# Altium schematic sheet ATtiny_Connections.SchDoc: ATiny_connections
size A4; Organization: Ernst-Abbe-Hochschule Jena; Address1: FB Maschinenbau; Address2: Carl-Zeiss-Promenade 2; Address3: 07745 Jena; Address4: Germany; DocumentNumber: 2; SheetNumber: 2; SheetTotal: 3; SPICEModelCacheYXNNQHYV: <root> / <DocumentId>YXNNQHYV</DocumentId> / </root>
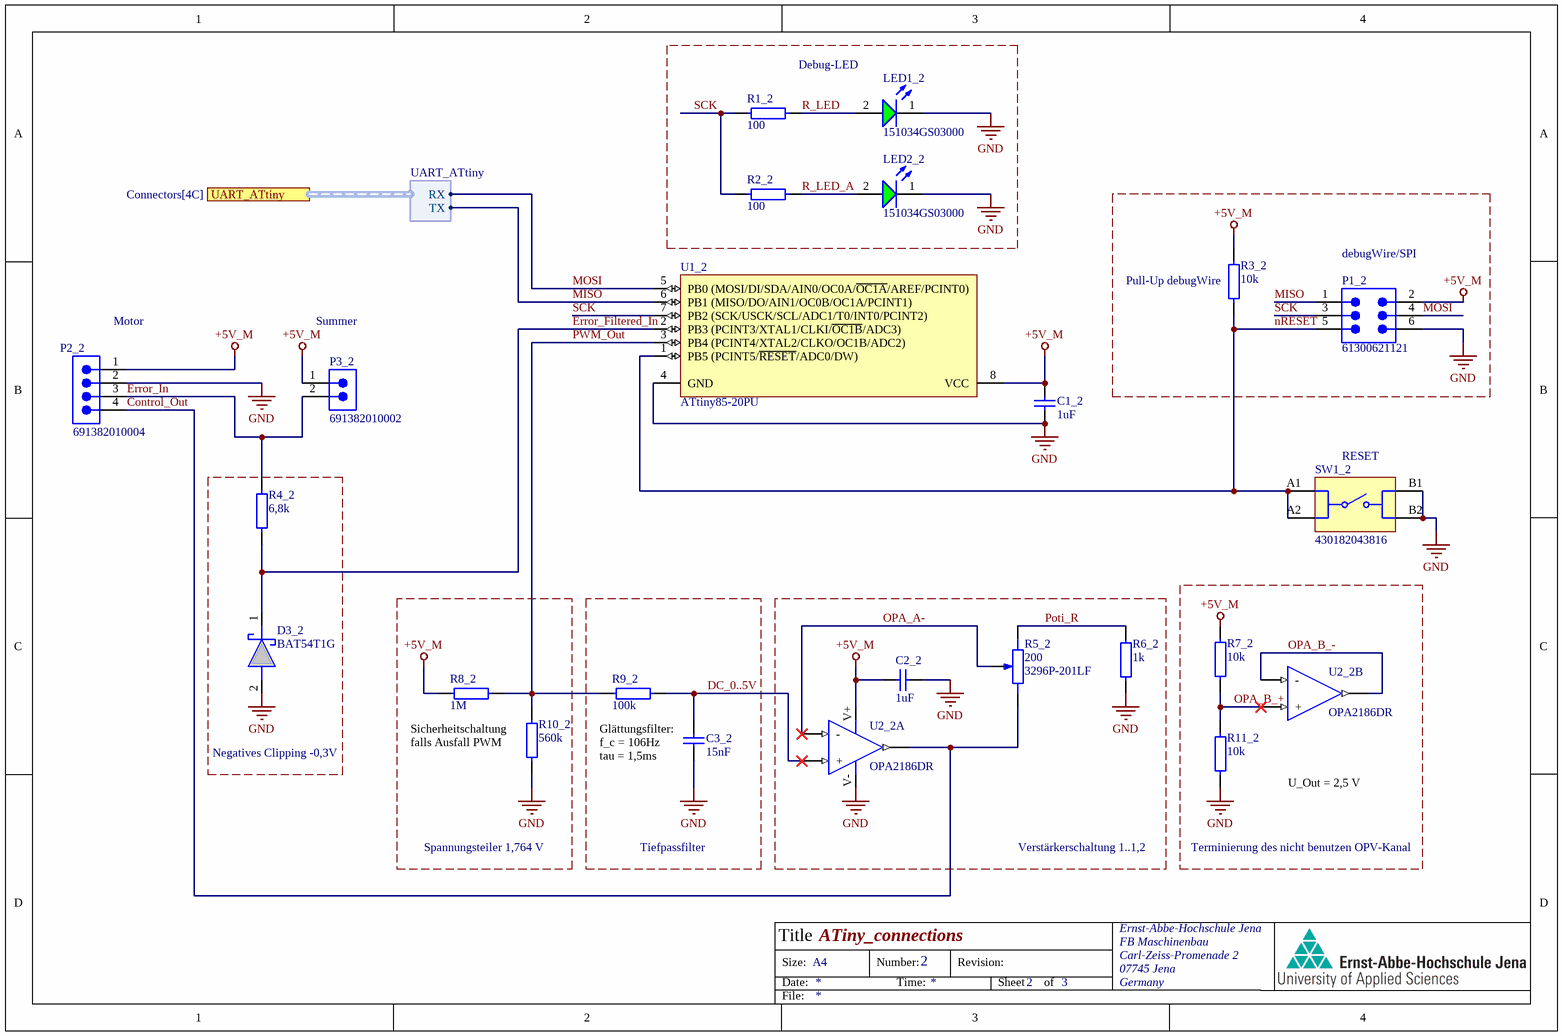
[diagram p0: ATtiny_Connections.SchDoc]

## Parts
C1_2  1uF  [SMD-0805]
C2_2  1uF  [SMD-0805]
C3_2  15nF  [SMD-0805]
D3_2  BAT54T1G  [SOD3716X135N]
LED1_2  Green, 3.2V, 30°  [WL-TMRW_D3.9H5.3]  (value not drawn)
LED2_2  Green, 3.2V, 30°  [WL-TMRW_D3.9H5.3]  (value not drawn)
P1_2  61300621121  [61300621121]
P2_2  691382010004  [691382010004]
P3_2  691382010002  [691382010002]
R1_2  100  [R-SMD-0805]
R2_2  100  [R-SMD-0805]
R3_2  10k  [R-SMD-0805]
R4_2  6,8k  [R-SMD-0805]
R5_2  200  Manufacturer Part Nr.: 3296P-201LF  [3296P-1-201LF]
R6_2  1k  [R-SMD-0805]
R7_2  10k  [R-SMD-0805]
R8_2  1M  [R-SMD-0805]
R9_2  100k  [R-SMD-0805]
R10_2  560k  [R-SMD-0805]
R11_2  10k  [R-SMD-0805]
SW1_2  430182043816  [430182043816]
U1_2  ATtiny85-20PU  [8P3]
U2_2  OPA2186DR  [SOIC127P600-8BM]  (parts A,B of 2)

## Blocks framed on the sheet
Debug-LED: LED1_2 LED2_2 R1_2 R2_2
Negatives Clipping -0,3V: D3_2 R4_2
Spannungsteiler 1,764 V: R8_2 R10_2
Tiefpassfilter: C3_2 R9_2
Verstärkerschaltung 1..1,2: C2_2 R5_2 R6_2 U2_2
Terminierung des nicht benutzen OPV-Kanal: R7_2 R11_2 U2_2

## Ports
UART_ATtiny (harness UART_ATtiny, see Connectors[4C])

## Harnesses
UART_ATtiny: RX, TX

## Nets
+5V_M: C1_2.2 C2_2.2 P1_2.2 P2_2.1 P3_2.1 R3_2.2 R7_2.2 R8_2.1 U1_2.8(VCC) U2_2.V+
GND: C1_2.1 C2_2.1 C3_2.1 D3_2.2(A) LED1_2.1(K) LED2_2.1(K) P1_2.6 P2_2.2 R6_2.2 R10_2.1 R11_2.1 SW1_2.B1 SW1_2.B2 U1_2.4(GND) U2_2.V-
Control_Out: P2_2.4 R5_2.1 U2_2.OUTA(OUT)
DC_0..5V: C3_2.2 R9_2.2 U2_2.IPA(+)
Error_Filtered_In: D3_2.1(K) R4_2.1 U1_2.2(PB3_(PCINT3/XTAL1/CLKI/~{OC1B}/ADC3))
Error_In: P2_2.3 P3_2.2 R4_2.2
MISO: P1_2.1 U1_2.6(PB1_(MISO/DO/AIN1/OC0B/OC1A/PCINT1)) ; port UART_ATtiny.TX
MOSI: P1_2.4 U1_2.5(PB0_(MOSI/DI/SDA/AIN0/OC0A/~{OC1A}/AREF/PCINT0)) ; port UART_ATtiny.RX
nRESET: P1_2.5 R3_2.1 SW1_2.A1 SW1_2.A2 U1_2.1(PB5_(PCINT5/~{RESET}/ADC0/DW))
OPA_A-: R5_2.2(TAP) U2_2.INA(-)
OPA_B_+: R7_2.1 R11_2.2 U2_2.IPB(+)
OPA_B_-: U2_2.INB(-) U2_2.OUTB(OUT)
Poti_R: R5_2.3 R6_2.1
PWM_Out: R8_2.2 R9_2.1 R10_2.2 U1_2.3(PB4_(PCINT4/XTAL2/CLKO/OC1B/ADC2))
R_LED: LED1_2.2(A) R1_2.2
R_LED_A: LED2_2.2(A) R2_2.2
SCK: P1_2.3 R1_2.1 R2_2.1 U1_2.7(PB2_(SCK/USCK/SCL/ADC1/T0/INT0/PCINT2))

## Notes on the sheet
- (near R3_2) Pull-Up debugWire
- (near P1_2) debugWire/SPI
- (near P2_2) Motor
- Summer
- (near SW1_2) RESET
- (near R10_2) Sicherheitschaltung falls Ausfall PWM
- (near C3_2) Glättungsfilter:
  f_c = 106Hz
  tau = 1,5ms
- U_Out = 2,5 V
- Title
- Size:
- Date:
- A4
- Number:
- Time:
- Revision:
- Sheet
- of
- File:

## Library data of the parts
C1_2 C2_2 C3_2 = C: Kondensator
  C1_2 C2_2: Value: 1uF
  C3_2: Value: 15nF
D3_2 = BAT54T1G: S Prefix for Automotive and Other Applications Requiring Unique Site and Control Change Requirements; AEC-Q101 Qualified and PPAP Capable; Low Forward Voltage 350 mV (Typ) @ IF = 10 mA; Extremely Fast Switching Speed; These Devices are Pb-Free, Halogen Free/BFR Free and are RoHS Compliant; Manufacturer_Name: onsemi; Geometry.Height: 1.35mm; Manufacturer_Part_Number: BAT54T1G; Mouser Part Number: 863-BAT54T1G; Mouser Price/Stock: https://www.mouser.co.uk/ProductDetail/onsemi/BAT54T1G?qs=vLkC5FC1VN9XK%252B%252BtdP3lYw%3D%3D; Arrow Part Number: BAT54T1G; Arrow Price/Stock: https://www.arrow.com/en/products/bat54t1g/on-semiconductor?utm_currency=USD&region=nac; Datasheet Link: https://www.onsemi.com/pub/Collateral/BAT54T1-D.PDF
LED1_2 LED2_2 = 151034GS03000: WL-TMRW Mono-color Round Waterclear, THT, D3.9 x H5.3mm, Green, 3.2V, 30°; Manufacturer: Wurth Elektronik; Chip Technology: InGaN; Dominant Wavelength: 530nm; Luminous Intensity: 10000mcd; Peak Wavelength: 525nm; Manufacturer Part Number: 151034GS03000; Category: Signal LEDs; Match Code: WL-TMRW; ComponentLink1Description: Website Link; ComponentLink1URL: https://www.we-online.com/redexpert/article/151034GS03000?ad; ComponentLink2Description: Datasheet Link; ComponentLink2URL: https://www.we-online.com/redexpert/spec/151034GS03000?ad; Mount: Through Hole; Operating Temperature Max: 85°C; Operating Temperature Min: -40°C; Packaging: Bulk; Height: 5.3mm; Diameter: 3.9mm; Emitting Color: Green; Forward Voltage: 3.2V; Viewing Angle: 30°
P1_2 = 61300621121: WR-PHD Pin Header, THT, Vertical, pitch 2.54mm, 2 Row, 6P; Manufacturer: Wurth Elektronik; Contact Resistance: 20mOhm; Rated Current: 3A; Working Voltage: 250V; Withstanding Voltage: 500V; Manufacturer Part Number: 61300621121; Category: Board-to-Board Connectors; Match Code: WR-PHD; ComponentLink1Description: Website Link; ComponentLink1URL: https://www.we-online.com/redexpert/article/61300621121?ad; ComponentLink2Description: Datasheet Link; ComponentLink2URL: https://www.we-online.com/redexpert/spec/61300621121?ad; Mount: Through Hole; Operating Temperature Max: 105°C; Operating Temperature Min: -40°C; Packaging: Bag; Gender: Pin Header; Number of Pins: 6; Number of Rows: 2; Orientation: Vertical; Pitch: 2.54mm
P2_2 = 691382010004: WR-TBL Series 382 Horizontal PCB Header, THT, pitch 2.5mm, 04p; Manufacturer: Wurth Elektronik; Modularity: No; Rated Current: 12A; System: Pluggable Connector; Working Voltage: 300V; Manufacturer Part Number: 691382010004; Category: Terminal Block; Match Code: WR-TBL; ComponentLink1Description: Website Link; ComponentLink1URL: https://www.we-online.com/redexpert/article/691382010004?ad; ComponentLink2Description: Datasheet Link; ComponentLink2URL: https://www.we-online.com/redexpert/spec/691382010004?ad; Mount: Through Hole; Min Operating Temperature: -40°C; Max Operating Temperature: 105°C; Packaging: Box; Application: Pluggable; Number of Pins: 4; Number of Rows: 1; Orientation: Horizontal; Pitch: 2.5mm
P3_2 = 691382010002: WR-TBL Series 382 Horizontal PCB Header, THT, pitch 2.5mm, 02p; Manufacturer: Wurth Elektronik; Modularity: No; Rated Current: 12A; System: Pluggable Connector; Working Voltage: 300V; Manufacturer Part Number: 691382010002; Category: Terminal Block; Match Code: WR-TBL; ComponentLink1Description: Website Link; ComponentLink1URL: https://www.we-online.com/redexpert/article/691382010002?ad; ComponentLink2Description: Datasheet Link; ComponentLink2URL: https://www.we-online.com/redexpert/spec/691382010002?ad; Mount: Through Hole; Min Operating Temperature: -40°C; Max Operating Temperature: 105°C; Packaging: Box; Application: Pluggable; Number of Pins: 2; Number of Rows: 1; Orientation: Horizontal; Pitch: 2.5mm
R1_2 R2_2 R3_2 R4_2 R6_2 R7_2 R8_2 R9_2 R10_2 R11_2 = R: Widerstand
  R1_2 R2_2: Value: 100
  R3_2 R7_2 R11_2: Value: 10k
  R4_2: Value: 6,8k
  R6_2: Value: 1k
  R8_2: Value: 1M
  R9_2: Value: 100k
  R10_2: Value: 560k
R5_2 = 3296P-1-201LF: Trimmer Potentiometers / Lead Sealed Type Multiturn Trimming Potentiometer / Resistance range: 200 Ohm / 25 Turns; PartNumber: PV36P???C01B00; Resistance Code: ***; Hinweis!: PartNumber muss beim Plazieren auf den Wiederstandswert laut Datenblatt abgeändert werden.; Turns: 25; Tol: +-10%; ComponentLink1Description: Datasheet; ComponentLink1URL: https://www.bourns.com/docs/Product-Datasheets/3296.pdf; Supplier 1: DigiKey; Supplier 2: Mouser; Supplier Part Number 2: 652-3296P-1-201LF; Supplier Part Number 1: 3296P-201LF-ND; Value: 200
SW1_2 = 430182043816: WS-TASV SMT Tact Switch, 6mm x 6mm, 160gf, SPST-NO, 12V, 50mA; Manufacturer: Wurth Elektronik; Washable: No; Manufacturer Part Number: 430182043816; Category: Tact Switch; Match Code: WS-TASV; ComponentLink1Description: Website Link; ComponentLink1URL: https://www.we-online.com/redexpert/article/430182043816?ad; ComponentLink2Description: Datasheet Link; ComponentLink2URL: https://www.we-online.com/redexpert/spec/430182043816?ad; Mount: Surface Mount; Min Operating Temperature: -40°C; Max Operating Temperature: 85°C; Packaging: Tape and Reel; Length: 6mm; Width: 6mm; Height: 4.3mm; Circuit: SPST-NO; Contact Material: Stainless Steel; Contact Plating: Silver; Operation Force: 160gf; Rated Current: 50mA; Rated Voltage (DC): 12V; Terminal Material: Copper Alloy; Terminal Plating: Silver
U1_2 = ATtiny85-20PU: 8-bit AVR Microcontroller, 20MHz, 2.7-5.5V, 8K Flash, 512 Bytes EEPROM, 512 Bytes SRAM, Industrial Grade (-40°C to 85°C), 8-Lead PDIP, Pb-Free; DatasheetVersion: revN, Apr-2011; PackageVersion: revB, Jan-2002; PackageReference: 8P3; PackageDescription: 8-Lead, 0.300" Wide Body, Plastic Dual In-Line Package (PDIP); Code_JEDEC: MS-001-BA; ComponentLink1Description: Manufacturer URL; ComponentLink1URL: http://www.atmel.com/; ComponentLink2Description: ATtiny25/45/85 Datasheet; ComponentLink2URL: http://www.atmel.com/dyn/resources/prod_documents/doc2586.pdf; ComponentLink3Description: ATtiny25/45/85 Summary; ComponentLink3URL: http://www.atmel.com/dyn/resources/prod_documents/2586S.pdf
U2_2 = OPA2186: The OPA186, OPA2186, and OPA4186 (OPAx186) / are low-power, 24-V, rail-to-rail input and output, zerodrift operational amplifiers (op amps). These op amps / feature only 10 µV of offset voltage (maximum) and / 0.04 µV/°C of offset voltage drift over temperature / (maximum).; pin to pad: INA>2 INB>6 IPA>3 IPB>5 OUTA>1 OUTB>7 V+>8 V->4; V+_Max: +12V; V-_Min: -12V; PartNumber: OPA2186DR; ComponentLink1Description: DataSheet; ComponentLink1URL: https://www.ti.com/lit/gpn/opa2186; Supplier 1: Digikey; Supplier 2: Mouser; Supplier Part Number 1: 296-OPA2186DRCT-ND; Supplier Part Number 2: 595-OPA2186DR